# Altium project wah.PRJPCB
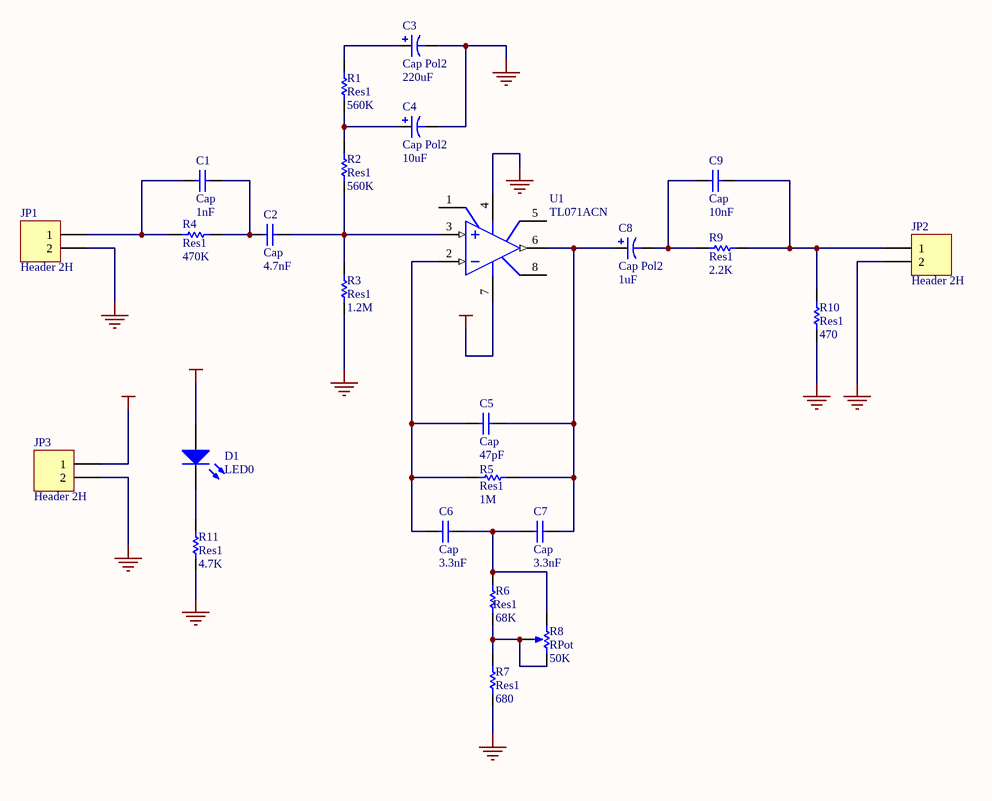
[diagram p0: wah.SCHDOC]
1 sheet, 25 parts. Net scope: global (net labels, ports and power ports of the same name join across sheets).
Board file: wah.PCBDOC

## Sheet wah.SCHDOC
size A4

### Parts
C1  Cap  value 1nF  [CAPR2.54-5.1X3.2]
C2  Cap  value 4.7nF  [CAPR2.54-5.1X3.2]
C3  Cap Pol2  value 220uF  [CAPPR2-5X6.8]
C4  Cap Pol2  value 10uF  [CAPPR2-5X6.8]
C5  Cap  value 47pF  [CAPR2.54-5.1X3.2]
C6  Cap  value 3.3nF  [CAPR2.54-5.1X3.2]
C7  Cap  value 3.3nF  [CAPR2.54-5.1X3.2]
C8  Cap Pol2  value 1uF  [CAPPR2-5X6.8]
C9  Cap  value 10nF  [CAPR2.54-5.1X3.2]
D1  LED0  [BAT-2]
JP1  Header 2H  [HDR1X2]
JP2  Header 2H  [HDR1X2]
JP3  Header 2H  [HDR1X2]
R1  Res1  value 560K  [AXIAL-0.3]
R2  Res1  value 560K  [AXIAL-0.3]
R3  Res1  value 1.2M  [AXIAL-0.3]
R4  Res1  value 470K  [AXIAL-0.3]
R5  Res1  value 1M  [AXIAL-0.3]
R6  Res1  value 68K  [AXIAL-0.3]
R7  Res1  value 680  [AXIAL-0.3]
R8  RPot  value 50K  [VR5]
R9  Res1  value 2.2K  [AXIAL-0.3]
R10  Res1  value 470  [AXIAL-0.3]
R11  Res1  value 4.7K  [AXIAL-0.3]
U1  TL071ACN  [DIP8]

### Nets
GND: C3.2 C4.2 JP1.2 JP2.2 JP3.2 R3.1 R7.1 R10.1 R11.1 U1.4(V-)
VCC: D1.1(A) JP3.1 U1.7(V+)
NetC1_1: C1.1 JP1.1 R4.1
NetC1_2: C1.2 C2.1 R4.2
NetC2_2: C2.2 R2.1 R3.2 U1.3(IN+)
NetC3_1: C3.1 R1.2
NetC4_1: C4.1 R1.1 R2.2
NetC5_1: C5.1 C6.1 R5.1 U1.2(IN-)
NetC5_2: C5.2 C7.2 C8.1 R5.2 U1.6(OUT)
NetC6_2: C6.2 C7.1 R6.2 R8.1(TOP)
NetC8_2: C8.2 C9.1 R9.2
NetC9_2: C9.2 JP2.1 R9.1 R10.2
NetD1_2: D1.2(K) R11.2
NetR6_1: R6.1 R7.2 R8.2(BOT) R8.3(TAP)

Not connected (* = marked no-connect by the designer): U1 1(OS_NULL) 5(OS_NULL) 8(NC)

### Library data of the parts
C1 C2 C5-C7 C9 = Cap: Capacitor; Published: 8-Jun-2000; Revision: July-2002: Re-released for DXP Platform.; Publisher: Altium Limited
C3 C4 C8 = Cap Pol2: Polarized Capacitor (Axial); Published: 8-Jun-2000; Revision: July-2002: Re-released for DXP Platform.; Publisher: Altium Limited
D1 = LED0: Typical INFRARED GaAs LED; Published: 8-Jun-2000; Revision: July-2002: Re-released for DXP Platform.; Publisher: Altium Limited
JP1-JP3 = Header 2H: Header, 2-Pin, Right Angle; Revision: 17-Jul-2002: Re-released for DXP Platform.; Publisher: Altium Limited
R1-R7 R9-R11 = Res1: Resistor; Published: 8-Jun-2000; Revision: July-2002: Re-released for DXP Platform.; Publisher: Altium Limited
R8 = RPot: Potentiometer; Set Position: 0.5; Published: 8-Jun-2000; Revision: July-2002: Re-released for DXP Platform.; Publisher: Altium Limited
U1 = TL071ACN: Low-Noise J-FET Single Operational Amplifier; Code - JEDEC: MO-001-AN; Published: 24-Aug-2001; Revision: 17-Jul-2002: Re-released for DXP Platform.; Datasheet: Latest Revision: Dec-1998; Package Reference: DIP8; Publisher: Altium Limited